# EAGLE schematic titan (EAGLE 7.5.0)
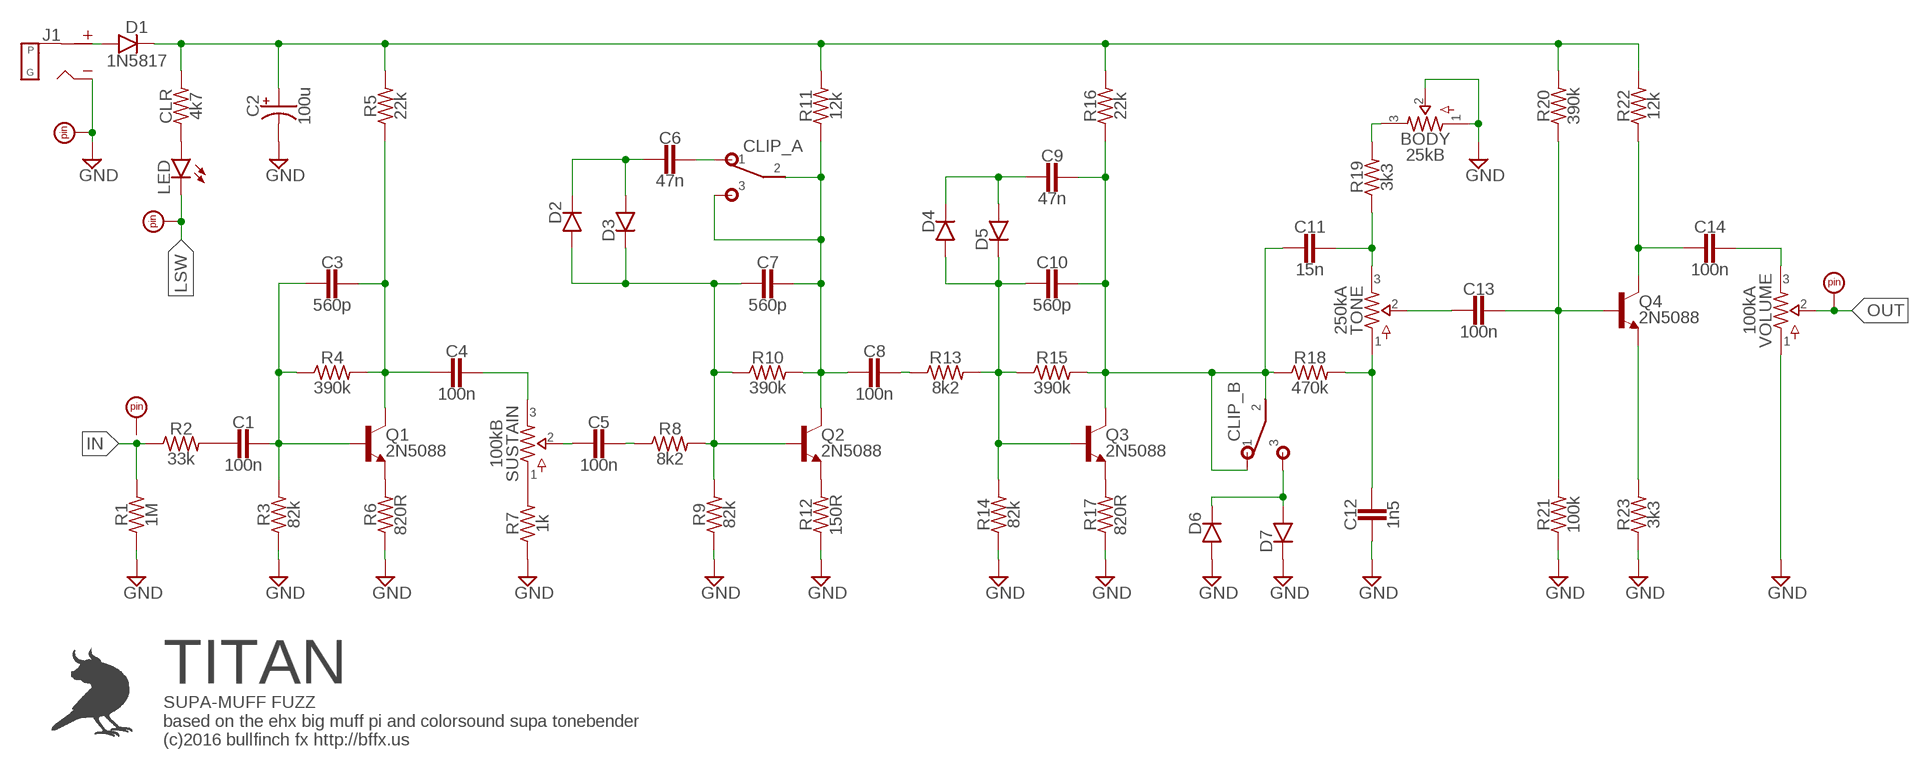
[diagram p0: schematic, sheet 1]

## Parts
BODY  25kB  POTS16MM  [16MM]
C1  100n  CER/FILM2  [050X030_025_2]
C2  100u  0501  [050_020_1]
C3  560p  CER/FILM2  [050X030_025_2]
C4  100n  CER/FILM2  [050X030_025_2]
C5  100n  CER/FILM2  [050X030_025_2]
C6  47n  CER/FILM2  [050X030_025_2]
C7  560p  CER/FILM2  [050X030_025_2]
C8  100n  CER/FILM2  [050X030_025_2]
C9  47n  CER/FILM2  [050X030_025_2]
C10  560p  CER/FILM2  [050X030_025_2]
C11  15n  CER/FILM2  [050X030_025_2]
C12  1n5  CER/FILM2  [050X030_025_2]
C13  100n  CER/FILM2  [050X030_025_2]
C14  100n  CER/FILM2  [050X030_025_2]
CLIP  DPDTPADS  [DPDT_PADS]
CLR  4k7  R_.3B  [R0207/3]
D1  1N5817  DO41.3  [DO41-3]
D2  DO35.2  [DO35-2]
D3  DO35.2  [DO35-2]
D4  DO35.2  [DO35-2]
D5  DO35.2  [DO35-2]
D6  DO35.2  [DO35-2]
D7  DO35.2  [DO35-2]
GND  PADRND  [ROUND]
IN  PADSQR  [SQUARE]
J1  DC_MONO  [DC]
LED  LEDA  [3MM_A]
LSW  PADSQR  [SQUARE]
OUT  PADSQR  [SQUARE]
Q1  2N5088  [TO92-]
Q2  2N5088  [TO92-]
Q3  2N5088  [TO92-]
Q4  2N5088  [TO92-]
R1  1M  R_.3B  [R0207/3]
R2  33k  R_.3B  [R0207/3]
R3  82k  R_.3B  [R0207/3]
R4  390k  R_.3B  [R0207/3]
R5  22k  R_.3B  [R0207/3]
R6  820R  R_.3B  [R0207/3]
R7  1k  R_.3B  [R0207/3]
R8  8k2  R_.3B  [R0207/3]
R9  82k  R_.3B  [R0207/3]
R10  390k  R_.3B  [R0207/3]
R11  12k  R_.3B  [R0207/3]
R12  150R  R_.3B  [R0207/3]
R13  8k2  R_.3B  [R0207/3]
R14  82k  R_.3B  [R0207/3]
R15  390k  R_.3B  [R0207/3]
R16  22k  R_.3B  [R0207/3]
R17  820R  R_.3B  [R0207/3]
R18  470k  R_.3B  [R0207/3]
R19  3k3  R_.3B  [R0207/3]
R20  390k  R_.3B  [R0207/3]
R21  100k  R_.3B  [R0207/3]
R22  12k  R_.3B  [R0207/3]
R23  3k3  R_.3B  [R0207/3]
SUSTAIN  100kB  POTS16MM  [16MM]
TONE  250kA  POTS16MM  [16MM]
VOLUME  100kA  POTS16MM  [16MM]

## Nets
GND: BODY.1 BODY.2 C2.- C12.2 D6.A D7.C GND.1 J1.S(SLEEVE) R1.1 R3.1 R6.1 R7.1 R9.1 R12.1 R14.1 R17.1 R21.1 R23.1 VOLUME.1
IN: R1.2 R2.1
LSW: LED.K(C) LSW.1
N$1: Q1.3(E) R6.2
N$2: R7.2 SUSTAIN.1
N$3: Q2.3(E) R12.2
N$4: C8.1 R13.1
N$5: C14.1 VOLUME.3
N$6: C1.2 R2.2
N$7: C1.1 C3.2 Q1.2(B) R3.2 R4.1
N$8: C3.1 C4.2 Q1.1(C) R4.2 R5.1
N$10: C4.1 SUSTAIN.3
N$11: C5.2 SUSTAIN.2
N$12: C5.1 R8.1
N$13: C11.1 R19.1 TONE.3
N$14: C7.1 C8.2 CLIP.P$2 CLIP.P$3 Q2.1(C) R10.2 R11.1
N$15: C6.2 D2.C D3.A
N$16: C7.2 D2.A D3.C Q2.2(B) R8.2 R9.2 R10.1
N$17: C12.1 R18.2 TONE.1
N$18: Q3.3(E) R17.2
N$20: C9.1 C10.1 C11.2 CLIP.P$4 CLIP.P$5 Q3.1(C) R15.2 R16.1 R18.1
N$21: C9.2 D4.C D5.A
N$22: C10.2 D4.A D5.C Q3.2(B) R13.2 R14.2 R15.1
N$23: BODY.3 R19.2
N$24: CLIP.P$6 D6.C D7.A
N$25: C6.1 CLIP.P$1
N$26: C13.2 TONE.2
N$27: CLR.1 LED.A
N$28: D1.A J1.T(TIP)
N$29: C2.+ CLR.2 D1.C R5.2 R11.2 R16.2 R20.2 R22.2
N$30: C13.1 Q4.2(B) R20.1 R21.2
N$31: Q4.3(E) R23.2
N$32: C14.2 Q4.1(C) R22.1
OUT: OUT.1 VOLUME.2
Unconnected: IN.1

## Notes on the sheet
- TITAN
- SUPA-MUFF FUZZ
  based on the ehx big muff pi and colorsound supa tonebender
  (c)2016 bullfinch fx http://bffx.us

## Library data of the parts
BODY SUSTAIN TONE VOLUME = potentiometers:POTS
C1 C3-C14 = capacitors-film:CER/FILM: 47 - 120pF Xicon Ceramic Disc 2.5mm lead spacing
C2 = capacitors-elec:050: 0.22 - 100uF Xicon values at Mouser.com: 10V: 10 - 100uF; 16V: 2.2 - 47uF; 25V: 0.47 - 47uF; 50V: 0.22 - 22uF
CLIP = switches:DPDT
CLR R1-R23 = resistors:R_
D1 = diodes:DO41: DO-41 Package Diodes: 1N4001 - 1N40019 Zener Diodes: 1N4728 - 1N4764
D2-D7 = diodes:DO35: DO-35 Package Diodes: 1N914
GND IN LSW OUT = supply pins:PAD
J1 = jacks:DC_MONO
LED = diodes:LED
Q1-Q4 = transistors:2N5088: NPN Transistor